# Altium schematic sheet CSI2-ZCU106-EVK-2_Rev01.SchDoc: CSI2-ZCU106-EVK_Rev01
size A2; PageSetup: Record=PageOptions|CenterHorizontal=True|CenterVertical=True|PrintScale=0.71|XCorrection=1.00|YCorrection=1.00|PrintKind=2|BorderSize=5000000|LeftOffset=0|BottomOffset=0|Orientation=2|PaperLength=1000|PaperWidth=1000|Scale=100|PaperSource=7|PrintQuality=-4|MediaType=1|DitherType=10|PrintScaleMode=1|PaperKind=A3; CheckedBy: HW-Devel; Author: CWA; CompanyName: Allied Vision Technologies GmbH; Address1: Taschenweg 2a; Address2: 07646 Stadtroda; Address3: Germany; Revision: 01; SheetNumber: 2; SheetTotal: 2
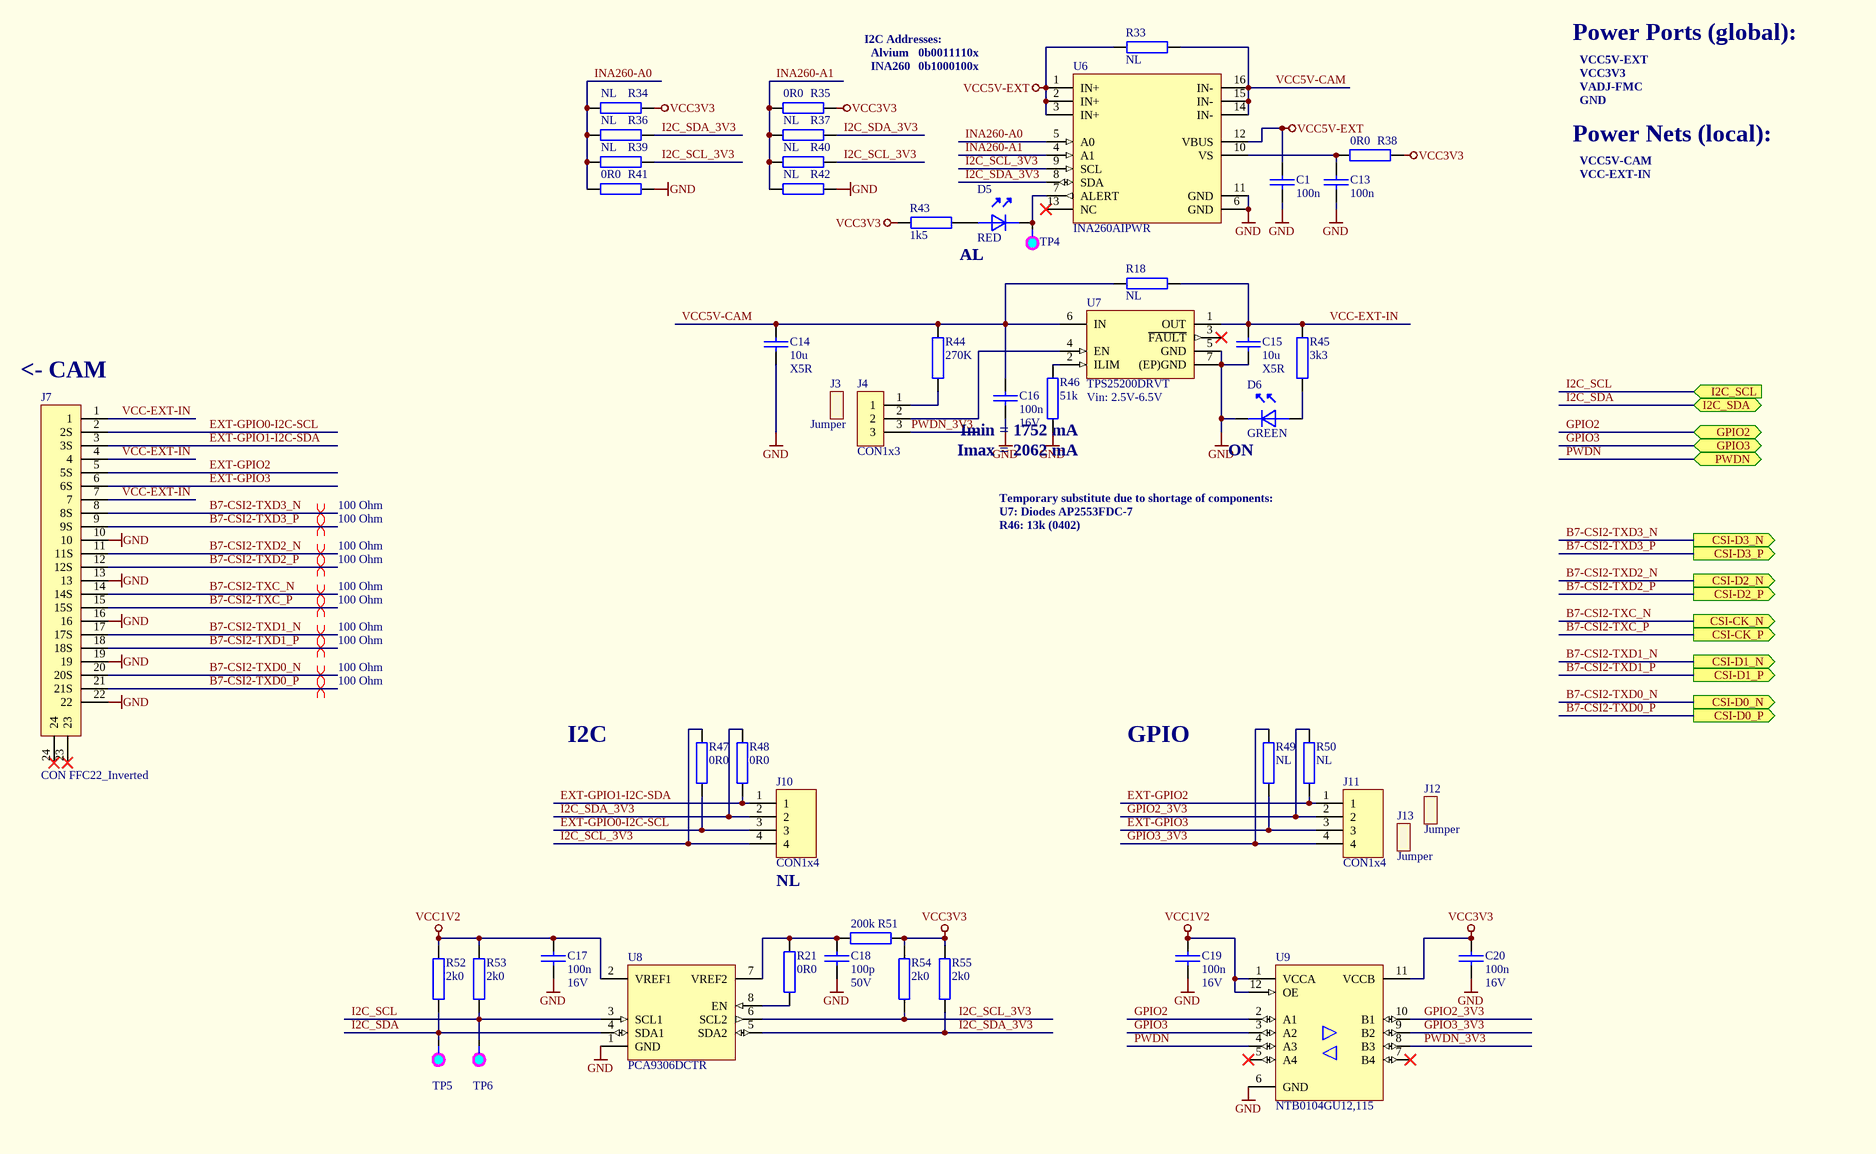
[diagram p0: CSI2-ZCU106-EVK-2_Rev01.SchDoc]

## Parts
C1  100n  [C-0402_0.55]
C13  100n  [C-0402_0.55]
C14  10u  Dielectric: X5R  [C-0805_1.4]
C15  10u  Dielectric: X5R  [C-0805_1.4]
C16  100n  Voltage: 16V  [C-0402_0.55]
C17  100n  Voltage: 16V  [C-0402_0.55]
C18  100p  Voltage: 50V  [C-0402_0.55]
C19  100n  Voltage: 16V  [C-0402_0.55]
C20  100n  Voltage: 16V  [C-0402_0.55]
D5  RED  [D-0603-LED]
D6  GREEN  [D-0603-LED]
J3  Jumper  [J-JUMPER-2.54]
J4  CON1x3  [CON 1x3 RM2.54]
J7  CON FFC22_Inverted  [J-FH55-22S-0.5SH - Inverted Pins]
J10  CON1x4  [CON 1x4 RM2.54]
J11  CON1x4  [CON 1x4 RM2.54]
J12  Jumper  [J-JUMPER-2.54]
J13  Jumper  [J-JUMPER-2.54]
R18  NL  [R-0603_0.6]
R21  0R0  [R-0603_0.6]
R33  NL  [R-0603_0.6]
R34  NL  [R-0603_0.6]
R35  0R0  [R-0603_0.6]
R36  NL  [R-0603_0.6]
R37  NL  [R-0603_0.6]
R38  0R0  [R-0603_0.6]
R39  NL  [R-0603_0.6]
R40  NL  [R-0603_0.6]
R41  0R0  [R-0603_0.6]
R42  NL  [R-0603_0.6]
R43  1k5  [R-0402_0.4]
R44  270K  [R-0402_0.4]
R45  3k3  [R-0402_0.4]
R46  51k  [R-0402_0.4]
R47  0R0  [R-0603_0.6]
R48  0R0  [R-0603_0.6]
R49  NL  [R-0603_0.6]
R50  NL  [R-0603_0.6]
R51  200k  [R-0402_0.4]
R52  2k0  [R-0402_0.4]
R53  2k0  [R-0402_0.4]
R54  2k0  [R-0402_0.4]
R55  2k0  [R-0402_0.4]
TP4  TP  [TP_16_10]  (value not drawn)  (no BOM)
TP5  TP  [TP_16_10]  (value not drawn)  (no BOM)
TP6  TP  [TP_16_10]  (value not drawn)  (no BOM)
U6  INA260AIPWR  [IC-TSSOP16 6.4x5.1x1.2]
U7  TPS25200DRVT  Vin: 2.5V-6.5V  [IC-DFN06_2.0x2.0x0.8]
U8  PCA9306DCTR  [IC-TSSOP8_3.15x4.25x1.3]
U9  NTB0104GU12,115  [IC-XQFN12_1.7x2x0.5]

## Ports
CSI-CK_N (out), CSI-CK_P (out), CSI-D0_N (out), CSI-D0_P (out), CSI-D1_N (out), CSI-D1_P (out), CSI-D2_N (out), CSI-D2_P (out), CSI-D3_N (out), CSI-D3_P (out), GPIO2 (bidir), GPIO3 (bidir), I2C_SCL (in), I2C_SDA (bidir), PWDN (bidir)

## Nets
GND: C1.2 C13.2 C14.2 C15.2 C16.2 C17.2 C18.2 C19.2 C20.2 D6.K J7.10 J7.13 J7.16 J7.19 J7.22 R41.1 R42.1 R46.1 U6.6(GND) U6.11(GND) U7.5(GND) U7.7((EP)GND) U8.1(GND) U9.6(GND)
VCC1V2: C17.1 C19.1 R52.1 R53.1 U8.2(VREF1) U9.1(VCCA) U9.12(OE)
VCC3V3: C20.1 R34.1 R35.1 R38.1 R43.1 R51.2 R54.2 R55.2 U9.11(VCCB)
VCC5V-EXT: C1.1 R33.2 U6.1(IN+) U6.2(IN+) U6.3(IN+) U6.12(VBUS)
B7-CSI2-TXC_N: J7.14(14S) ; port CSI-CK_N
B7-CSI2-TXC_P: J7.15(15S) ; port CSI-CK_P
B7-CSI2-TXD0_N: J7.20(20S) ; port CSI-D0_N
B7-CSI2-TXD0_P: J7.21(21S) ; port CSI-D0_P
B7-CSI2-TXD1_N: J7.17(17S) ; port CSI-D1_N
B7-CSI2-TXD1_P: J7.18(18S) ; port CSI-D1_P
B7-CSI2-TXD2_N: J7.11(11S) ; port CSI-D2_N
B7-CSI2-TXD2_P: J7.12(12S) ; port CSI-D2_P
B7-CSI2-TXD3_N: J7.8(8S) ; port CSI-D3_N
B7-CSI2-TXD3_P: J7.9(9S) ; port CSI-D3_P
EXT-GPIO0-I2C-SCL: J7.2(2S) J10.3 R47.1
EXT-GPIO1-I2C-SDA: J7.3(3S) J10.1 R48.1
EXT-GPIO2: J7.5(5S) J11.1 R50.1
EXT-GPIO3: J7.6(6S) J11.3 R49.1
GPIO2: U9.2(A1) ; port GPIO2
GPIO2_3V3: J11.2 R50.2 U9.10(B1)
GPIO3: U9.3(A2) ; port GPIO3
GPIO3_3V3: J11.4 R49.2 U9.9(B2)
I2C_SCL: R53.2 TP6.1 U8.3(SCL1) ; port I2C_SCL
I2C_SCL_3V3: J10.4 R39.1 R40.1 R47.2 R54.1 U6.9(SCL) U8.6(SCL2)
I2C_SDA: R52.2 TP5.1 U8.4(SDA1) ; port I2C_SDA
I2C_SDA_3V3: J10.2 R36.1 R37.1 R48.2 R55.1 U6.8(SDA) U8.5(SDA2)
INA260-A0: R34.2 R36.2 R39.2 R41.2 U6.5(A0)
INA260-A1: R35.2 R37.2 R40.2 R42.2 U6.4(A1)
PWDN: U9.4(A3) ; port PWDN
PWDN_3V3: J4.3 U9.8(B3)
VCC5V-CAM: C14.1 C16.1 R18.2 R33.1 R44.1 U6.14(IN-) U6.15(IN-) U6.16(IN-) U7.6(IN)
VCC-EXT-IN: C15.1 J7.1 J7.4 J7.7 R18.1 R45.1 U7.1(OUT)
NetC13_1: C13.1 R38.2 U6.10(VS)
NetC18_1: C18.1 R21.1 R51.1 U8.7(VREF2)
NetD5_A: D5.A R43.2
NetD5_K: D5.K TP4.1 U6.7(ALERT)
NetD6_A: D6.A R45.2
NetJ4_1: J4.1 R44.2
NetJ4_2: J4.2 U7.4(EN)
NetR21_2: R21.2 U8.8(EN)
NetR46_2: R46.2 U7.2(ILIM)

Not connected (* = marked no-connect by the designer): J7 23* 24*; U6 13(NC)*; U7 3(~{FAULT})*; U9 5(A4)* 7(B4)*

## Layout directives
differential pair; net class 100 Ohm: B7-CSI2-TXC_N, B7-CSI2-TXC_P, B7-CSI2-TXD0_N, B7-CSI2-TXD0_P, B7-CSI2-TXD1_N, B7-CSI2-TXD1_P, B7-CSI2-TXD2_N, B7-CSI2-TXD2_P, B7-CSI2-TXD3_N, B7-CSI2-TXD3_P

## Notes on the sheet
- I2C Addresses:
- Alvium
- INA260
- 0b0011110x
- 0b1000100x
- Power Ports (global):
- VCC5V-EXT
- VCC3V3
- Power Nets (local):
- VADJ-FMC
- GND
- VCC5V-CAM
- VCC-EXT-IN
- AL
- (near J7) <- CAM
- (near R46) Imin = 1752 mA
- Imax = 2062 mA
- (near D6) ON
- Temporary substitute due to shortage of components:
- U7: Diodes AP2553FDC-7
- R46: 13k (0402)
- I2C
- GPIO
- (near J10) NL
- Author:
- Title:
- PCB:
- Checked by:
- PCBA:
- 2
- 3
- Confidential
- File:
- Date:
- Page:
- of
- No.
- 1
- Changes
- Rev.:
- Name:

## Library data of the parts
C1 C13 = C 100N 10% 16V X7R 402: Capacitor Ceramic SMD/0402/16V/X7R/10%; KHK Part Number: K8340114; Manufacturer: several; Dielectric: X7R; Tolerance: 10%; Voltage: 16V; Manufacturer Part Number: several; Supplier 1: Digi-Key; Supplier 2: Digi-Key; Supplier Part Number 1: 1276-1508-1-ND; Supplier Part Number 2: 311-1338-1-ND
C14 C15 = C 10U 16V X5R 0805: Capacitor Ceramic SMD/0805/16V/X5R/10%; KHK Part Number: K8340151; Manufacturer: several; Tolerance: 10%; Voltage: 16V; Manufacturer Part Number: several; Supplier 1: Digi-Key; Supplier Part Number 1: 478-5165-1-ND
C16 C17 C19 C20 = C 100N 10% 16V X7R 402: Capacitor Ceramic SMD/0402/16V/X7R/10%; KHK Part Number: K8340114; Manufacturer: several; Dielectric: X7R; Tolerance: 10%; Manufacturer Part Number: several; Supplier 1: Digi-Key; Supplier 2: Digi-Key; Supplier Part Number 1: 1276-1508-1-ND; Supplier Part Number 2: 311-1338-1-ND
C18 = C 100P 50V X7R 0402: Capacitor Ceramic SMD/0402/50V/X7R/10%; KHK Part Number: K8340145; Manufacturer: several; Dielectric: X7R; Tolerance: 10%; Manufacturer Part Number: several; Supplier 1: Digi-Key; Supplier Part Number 1: 478-1089-1-ND
D5 = D LED 0603 red: Chip LED red 250mcd; KHK Part Number: 8145; Manufacturer: Würth; Manufacturer Part Number: 150060RS75000; Current: 20mA; Color: red; Supplier 1: Digi-Key; Supplier Part Number 1: 732-4978-1-ND
D6 = D LED 0603 green: Chip LED green 430mcd; KHK Part Number: 8172; Manufacturer: Würth; Manufacturer Part Number: 150060GS75000; Current: 20mA; Color: green; Supplier 1: Digi-Key; Supplier Part Number 1: 732-4971-1-ND
J3 J12 J13 = CON Jumper 2.54mm: CON/JUMPER/STC02SYAN; 2-pin; 2.54mm; 3A; FEMALE; VERTICAL; BLACK; KHK Part Number: 13444; Manufacturer: several; Manufacturer Part Number: several; Supplier 1: Digi-Key; Supplier Part Number 1: S9000-ND
J4 = CON 1x3 2.54 several: Header Vertical, 1x3 Pos, Pitch 2.54mm, Contact Length Mating 6.00mm, Contact Length Post 3.00mm, Insulation Height 2.54mm, Gold Plating; KHK Part Number: 15338; Manufacturer: several; Manufacturer Part Number: several; Supplier 1: Digi-Key; Supplier Part Number 1: 732-5316-ND
J7 = CON FFC22_FH55-22S-0.5SH_Inverted: FFC Connector 0.5mm shielded; KHK Part Number: 10357; Manufacturer: Hirose; Manufacturer Part Number: FH55-22S-0.5SH; Supplier 1: Mouser; Supplier Part Number 1: 798-FH55-22S-0.5SH
J10 J11 = CON 1x4 2.54 several: Header Vertical, 1x4 Pos, Pitch 2.54mm, Contact Length Mating 6.00mm, Contact Length Post 3.00mm, Insulation Height 2.54mm, Gold Plating; KHK Part Number: 15343; Manufacturer: several; Manufacturer Part Number: several; Supplier 1: Digi-Key; Supplier Part Number 1: 732-5317-ND
R18 R33 R34 R36 R37 R39 R40 R42 R49 R50 = R X 0603: Standard Resistor SMD/0603/1%/100mW/TK200; Temperature Coefficient: TK100; Tolerance: 1%
R21 R35 R38 R41 R47 R48 = R 0R0 1% 0603: Standard Resistor SMD/0603/1%/100mW/TK200; KHK Part Number: K8250041; Manufacturer: several; Tolerance: 1%; Manufacturer Part Number: several; Temperature Coefficient: *; Supplier 1: Digi-Key; Supplier Part Number 1: 311-0.0HRCT-ND
R43 = R 1k5 1% 0402: Standard Resistor SMD/0402/1%/63mW/TK100; KHK Part Number: K8250358; Manufacturer: several; Tolerance: 1%; Manufacturer Part Number: several; Supplier 1: Digi-Key; Supplier Part Number 1: 311-1.50KLRCT-ND
R44 = R 270K 1% 0402: Standard Resistor SMD/0402/1%/63mW/TK100; KHK Part Number: 3875; Manufacturer: several; Tolerance: 1%; Temperature Coefficient: TK100; Manufacturer Part Number: several; Supplier 1: Digi-Key; Supplier Part Number 1: CR0402-FX-2703GLFCT-ND
R45 = R 3K3 1% 0402: Standard Resistor SMD/0402/1%/63mW/TK100; KHK Part Number: K8250347; Manufacturer: several; Tolerance: 1%; Temperature Coefficient: TK100; Manufacturer Part Number: several; Supplier 1: Digi-Key; Supplier Part Number 1: 311-3.30KLRCT-ND
R46 = R 51K 1% 0402: Standard Resistor SMD/0402/1%/63mW/TK100; KHK Part Number: K8250273; Manufacturer: several; Tolerance: 1%; Temperature Coefficient: TK100; Manufacturer Part Number: several; Supplier 1: Digi-Key; Supplier Part Number 1: 311-51.0KLRCT-ND
R51 = R 200K 1% 0402: Standard Resistor SMD/0402/1%/63mW/TK100; KHK Part Number: K8250280; Manufacturer: several; Temperature Coefficient: TK100; Tolerance: 1%; Manufacturer Part Number: several; Supplier 1: Digi-Key; Supplier 2: Arrow; Supplier 3: Arrow; Supplier Part Number 1: 311-200KLRCT-ND; Supplier Part Number 2: CRCW0402200KFKED; Supplier Part Number 3: NRC04F2003TRF
R52-R55 = R 2k0 1% 0402: Standard Resistor SMD/0402/1%/63mW/TK100; KHK Part Number: K8250311; Manufacturer: several; Temperature Coefficient: TK100; Tolerance: 1%; Manufacturer Part Number: several; Supplier 1: Digi-Key; Supplier Part Number 1: 311-2KLRCT-ND
TP4-TP6 = TP_16_10: Testpoint: Pad=1,6mm; Hole=1,0mm
U6 = IC INA260: IC/PWR/CURR SHUNT MONITOR/2.7-5.5V;4.5mR/TSSOP16/5.0x4.4x1.2mm; Manufacturer: TI; Manufacturer Part Number: INA260AIPWR; Supplier 1: Digi-Key; Supplier Part Number 1: 296-47777-1-ND
U7 = IC  TPS25200DRVT: IC/PWR/LOADSW;2V5-6V5;2A5;0R099/6-WDFN/2x2x0.8mm; KHK Part Number: 14277; Manufacturer: Texas Instruments; I max: 2.5A; Manufacturer Part Number: TPS25200DRVT; Supplier 1: Digi-Key; Supplier Part Number 1: 296-37760-1-ND
U8 = IC PCA9306DCTR: IC/LOGIC/LEVELSHIFTER;I2C;AUTO-DIR;1V2-5V/SSOP-8/4.25x3.15x1.3mm; KHK Part Number: 9555; Manufacturer: TI; Manufacturer Part Number: PCA9306DCTR; Supplier 1: Digi-Key; Supplier Part Number 1: 296-18509-1-ND
U9 = IC NTB0104GU12,115: IC/LOGIC/Levelshifter;Auto-Dir;Bidirectional;Push-Pull;-40-+125°C/; Manufacturer: NXP; KHK Part Number: 14383; Manufacturer Part Number: NTB0104GU12,115; Supplier 1: Digi-Key; Supplier Part Number 1: 568-5204-1-ND